# EasyEDA schematic node1-esp32s3-waveshare.json
TITLE: Sheet_1; REV: 1.0; Date: 2024-01-11; Sheet: 1/1; Drawn By: Gabriel Thien; Company: Your Company
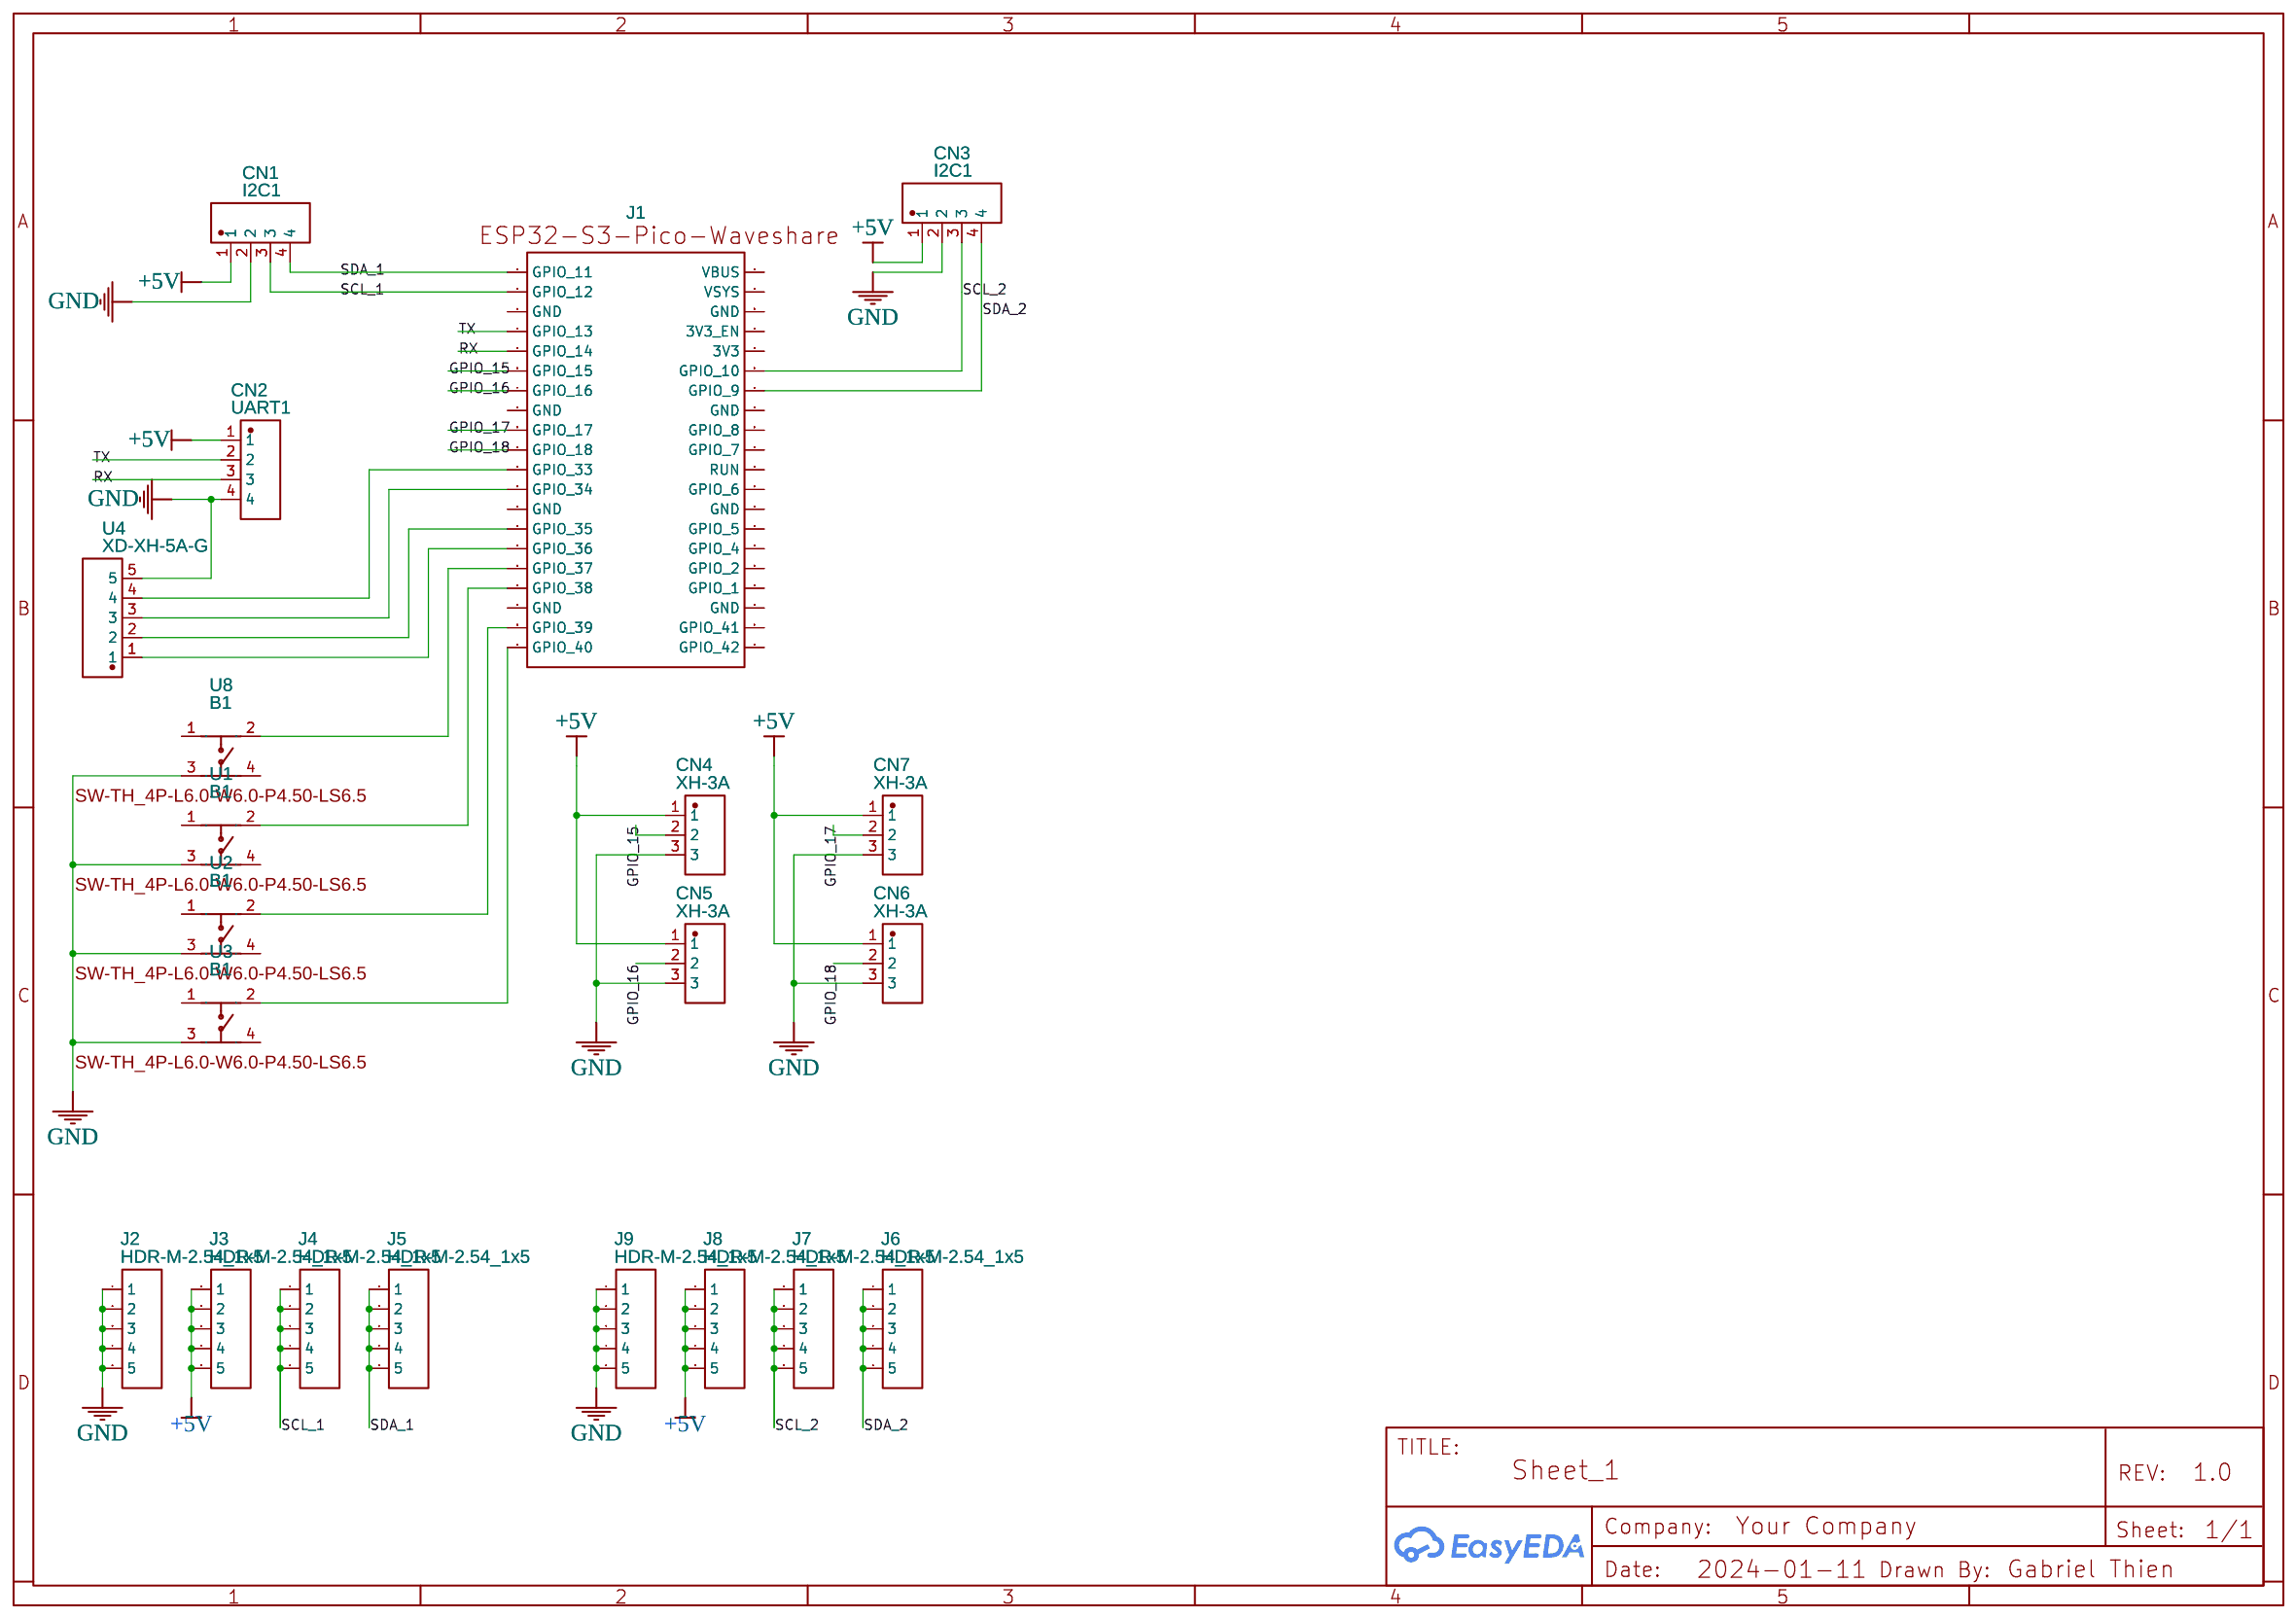
[diagram p0: schematic sheet]

## Parts
CN1  I2C1  [CONN-TH_XH-4A]
CN2  UART1  [CONN-TH_XH-4A]
CN3  I2C1  [CONN-TH_XH-4A]
CN4  XH-3A  [CONN-TH_XH-3A]
CN5  XH-3A  [CONN-TH_XH-3A]
CN6  XH-3A  [CONN-TH_XH-3A]
CN7  XH-3A  [CONN-TH_XH-3A]
J1  ESP32-S3-Pico-Waveshare-Symbol  [ESP32-S3-PICO]
J2  HDR-M-2.54_1x5  [HDR-M-2.54_1X5]
J3  HDR-M-2.54_1x5  [HDR-M-2.54_1X5]
J4  HDR-M-2.54_1x5  [HDR-M-2.54_1X5]
J5  HDR-M-2.54_1x5  [HDR-M-2.54_1X5]
J6  HDR-M-2.54_1x5  [HDR-M-2.54_1X5]
J7  HDR-M-2.54_1x5  [HDR-M-2.54_1X5]
J8  HDR-M-2.54_1x5  [HDR-M-2.54_1X5]
J9  HDR-M-2.54_1x5  [HDR-M-2.54_1X5]
U1  B1  [SW-TH_4P-L6.0-W6.0-P4.50-LS6.5]
U2  B1  [SW-TH_4P-L6.0-W6.0-P4.50-LS6.5]
U3  B1  [SW-TH_4P-L6.0-W6.0-P4.50-LS6.5]
U4  XD-XH-5A-G  [CONN-TH_XH-5A]
U8  B1  [SW-TH_4P-L6.0-W6.0-P4.50-LS6.5]

## Library data of the parts
CN1-CN3 = HEADER 4: Contributor: lcsc; Supplier: LCSC; Supplier Part: C9900017655; Manufacturer: null; Manufacturer Part: Header 4; JLCPCB Part Class: Extended Part
CN4-CN7 = XH-3A 红色: Contributor: LCSC; Supplier: LCSC; Supplier Part: C95019; Manufacturer: BOOMELE(博穆精密); JLCPCB Part Class: Extended Part
J1 = ESP32-S3-Pico-Waveshare-Symbol: Supplier Part: ESP32-S3-Pico; Supplier: LCSC; Manufacturer: Waveshare; Contributor: Gabriel Thien
J2-J9 = HDR-M-2.54_1x5: Supplier Part: C358687; Supplier: LCSC; Contributor: LCEDA_Lib
U1-U3 U8 = MJTP1230: Contributor: lcsc; Supplier: LCSC; Supplier Part: C4364832; Manufacturer: APEM; link: https://lcsc.com/eda_search?q=C4364832&%26type=1&ref=editor; Package Display: Yes
U4 = XD-XH-5A-G: Supplier: LCSC; Supplier Part: C17700949; Manufacturer: XUNDA(讯答); Contributor: lcsc

## Nets
+5V: CN1.1 CN2.1 CN3.1 CN4.1 CN5.1 CN6.1 CN7.1 J3.1 J3.2 J3.3 J3.4 J3.5 J8.1 J8.2 J8.3 J8.4 J8.5
GND: CN1.2 CN2.4 CN3.2 CN4.3 CN5.3 CN6.3 CN7.3 J2.1 J2.2 J2.3 J2.4 J2.5 J9.1 J9.2 J9.3 J9.4 J9.5 U1.3 U2.3 U3.3 U4.5 U8.3
GPIO_15: CN4.2 J1.6(GPIO_15)
GPIO_16: CN5.2 J1.7(GPIO_16)
GPIO_17: CN7.2 J1.9(GPIO_17)
GPIO_18: CN6.2 J1.10(GPIO_18)
RX: CN2.3 J1.5(GPIO_14)
SCL_1: CN1.3 J1.2(GPIO_12) J4.1 J4.2 J4.3 J4.4 J4.5
SCL_2: CN3.3 J1.35(GPIO_10) J7.1 J7.2 J7.3 J7.4 J7.5
SDA_1: CN1.4 J1.1(GPIO_11) J5.1 J5.2 J5.3 J5.4 J5.5
SDA_2: CN3.4 J1.34(GPIO_9) J6.1 J6.2 J6.3 J6.4 J6.5
TX: CN2.2 J1.4(GPIO_13)
Net-(J1-11): J1.11(GPIO_33) U4.4
Net-(J1-12): J1.12(GPIO_34) U4.3
Net-(J1-14): J1.14(GPIO_35) U4.2
Net-(J1-15): J1.15(GPIO_36) U4.1
Net-(J1-16): J1.16(GPIO_37) U8.2
Net-(J1-17): J1.17(GPIO_38) U1.2
Net-(J1-19): J1.19(GPIO_39) U2.2
Net-(J1-20): J1.20(GPIO_40) U3.2

Not connected (* = marked no-connect by the designer): J1 3(GND) 8(GND) 13(GND) 18(GND) 21(GPIO_42) 22(GPIO_41) 23(GND) 24(GPIO_1) 25(GPIO_2) 26(GPIO_4) 27(GPIO_5) 28(GND) 29(GPIO_6) 30(RUN) 31(GPIO_7) 32(GPIO_8) 33(GND) 36(3V3) 37(3V3_EN) 38(GND) 39(VSYS) 40(VBUS); U1 1 4; U2 1 4; U3 1 4; U8 1 4
